# Altium schematic sheet [01] Block Diagram.SchDoc
size A2; SheetNumber: 1; SheetTotal: 6
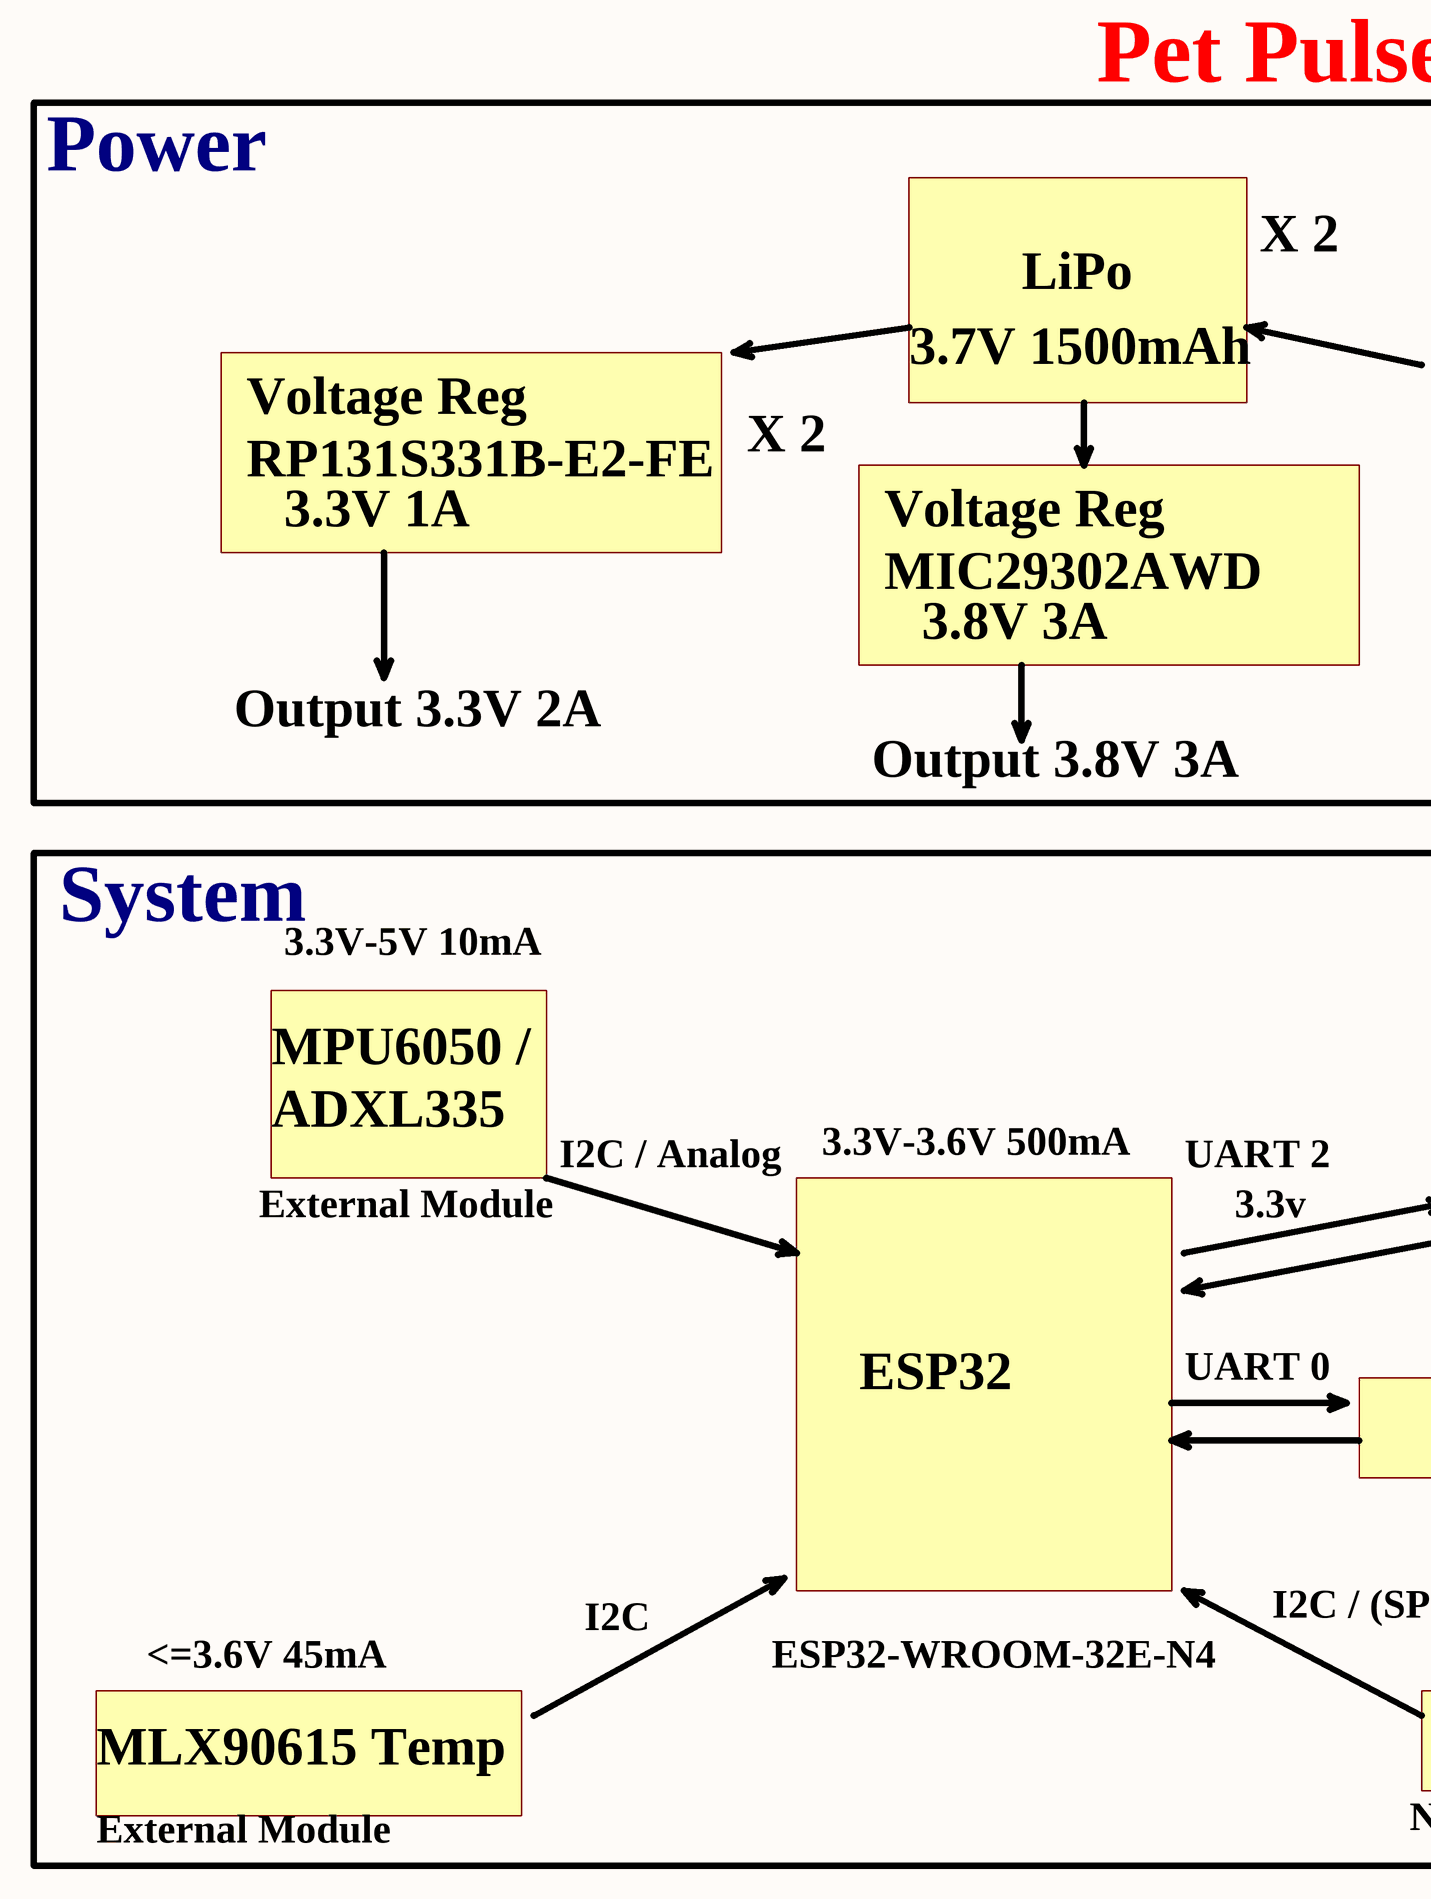
[diagram p0: [01] Block Diagram.SchDoc, left]
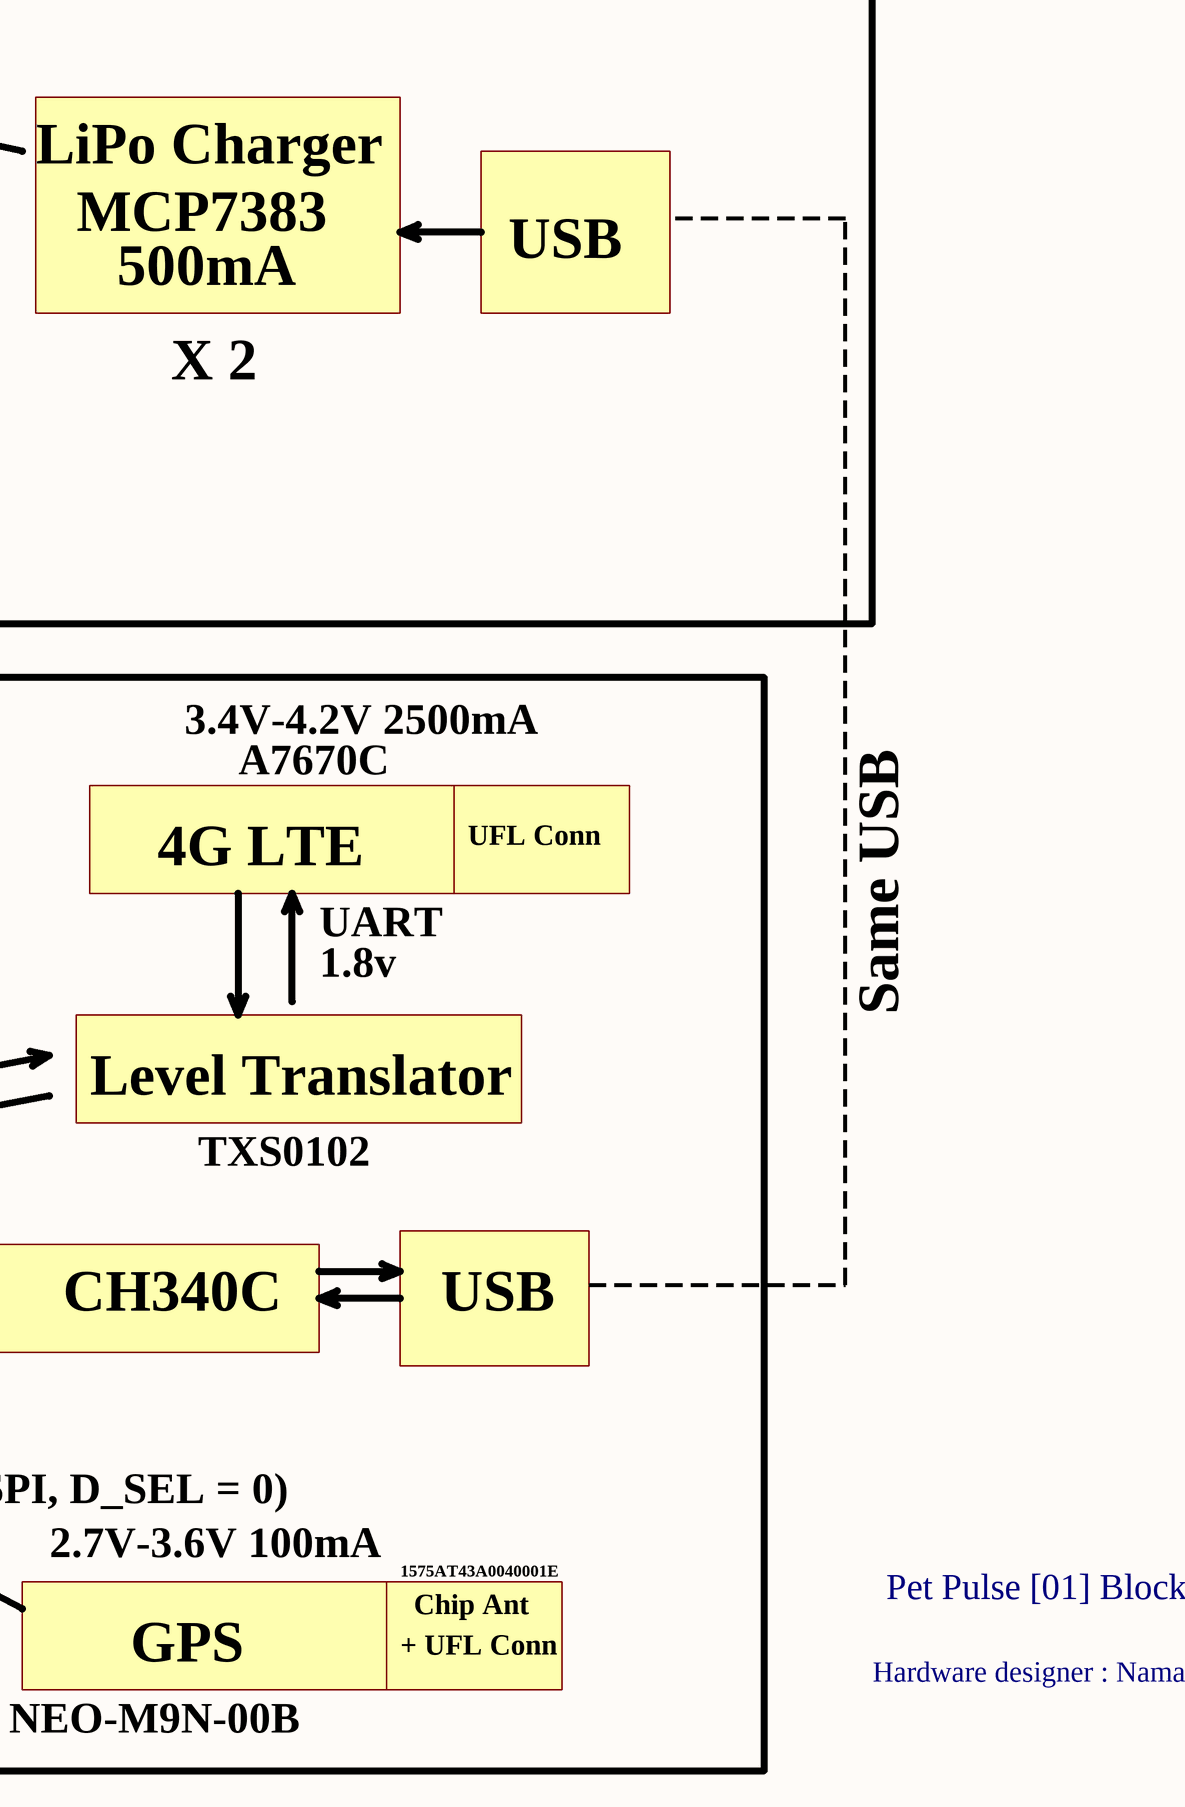
[diagram p1: [01] Block Diagram.SchDoc, right]

## Notes on the sheet
- Pet Pulse
- Power
- LiPo
- X 2
- 3.7V 1500mAh
- Voltage Reg
- LiPo Charger
- RP131S331B-E2-FE
- MCP7383
- 500mA
- USB
- 3.3V 1A
- MIC29302AWD
- 3.8V 3A
- Output 3.3V 2A
- Output 3.8V 3A
- System
- 3.4V-4.2V 2500mA
- 3.3V-5V 10mA
- A7670C
- 4G LTE
- UFL Conn
- MPU6050 /
- UART
- ADXL335
- I2C / Analog
- 3.3V-3.6V 500mA
- UART 2
- 1.8v
- Same USB
- External Module
- 3.3v
- Level Translator
- TXS0102
- ESP32
- UART 0
- CH340C
- I2C / (SPI, D_SEL = 0)
- <=3.6V 45mA
- I2C
- ESP32-WROOM-32E-N4
- 2.7V-3.6V 100mA
- 1575AT43A0040001E
- Chip Ant
- Pet Pulse [01] Block Diagram
- MLX90615 Temp
- GPS
- + UFL Conn
- Hardware designer : Naman Tanwar
- NEO-M9N-00B